# Altium schematic sheet valve_gpio.SchDoc
size A
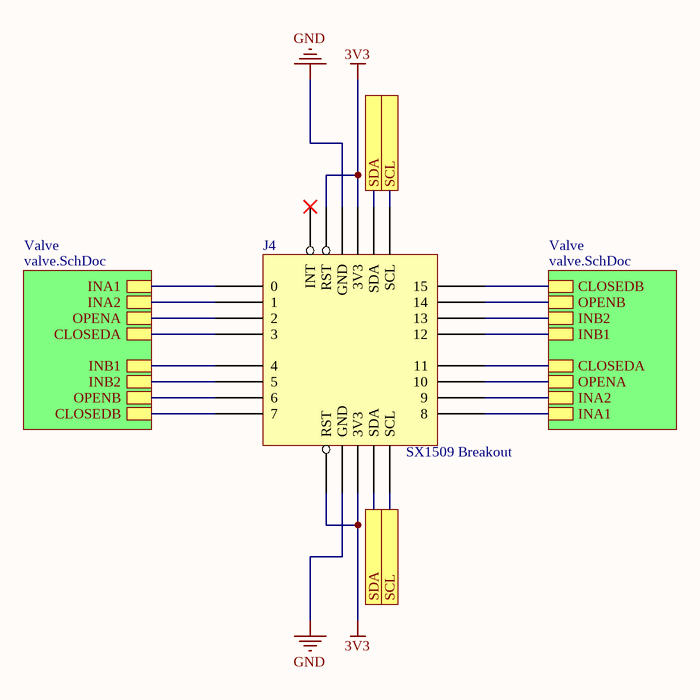
[diagram p0: valve_gpio.SchDoc]

## Parts
J4  SX1509 Breakout  [SX1509 Breakout]

## Sub-sheets
Valve = valve.SchDoc: INB1, INB2, CLOSEDA, OPENA, INA1, OPENB, INA2, CLOSEDB
Valve = valve.SchDoc: INB1, INB2, CLOSEDA, OPENA, INA1, OPENB, INA2, CLOSEDB

## Ports
SCL, SDA

## Nets
3V3: J4.9(RST) J4.11(3V3) J4.24(3V3) J4.26(RST)
GND: J4.10(GND) J4.25(GND)
SCL: J4.13(SCL) J4.22(SCL) ; port SCL
SDA: J4.12(SDA) J4.23(SDA) ; port SDA
NetJ4_1: J4.1(0) ; sheet Valve/INA1
NetJ4_2: J4.2(1) ; sheet Valve/INA2
NetJ4_3: J4.3(2) ; sheet Valve/OPENA
NetJ4_4: J4.4(3) ; sheet Valve/CLOSEDA
NetJ4_5: J4.5(4) ; sheet Valve/INB1
NetJ4_6: J4.6(5) ; sheet Valve/INB2
NetJ4_7: J4.7(6) ; sheet Valve/OPENB
NetJ4_8: J4.8(7) ; sheet Valve/CLOSEDB
NetJ4_14: J4.14(8) ; sheet Valve/INA1
NetJ4_15: J4.15(9) ; sheet Valve/INA2
NetJ4_16: J4.16(10) ; sheet Valve/OPENA
NetJ4_17: J4.17(11) ; sheet Valve/CLOSEDA
NetJ4_18: J4.18(12) ; sheet Valve/INB1
NetJ4_19: J4.19(13) ; sheet Valve/INB2
NetJ4_20: J4.20(14) ; sheet Valve/OPENB
NetJ4_21: J4.21(15) ; sheet Valve/CLOSEDB

Not connected (* = marked no-connect by the designer): J4 27(INT)*